# EAGLE schematic WaveFolder (EAGLE 9.6.2)
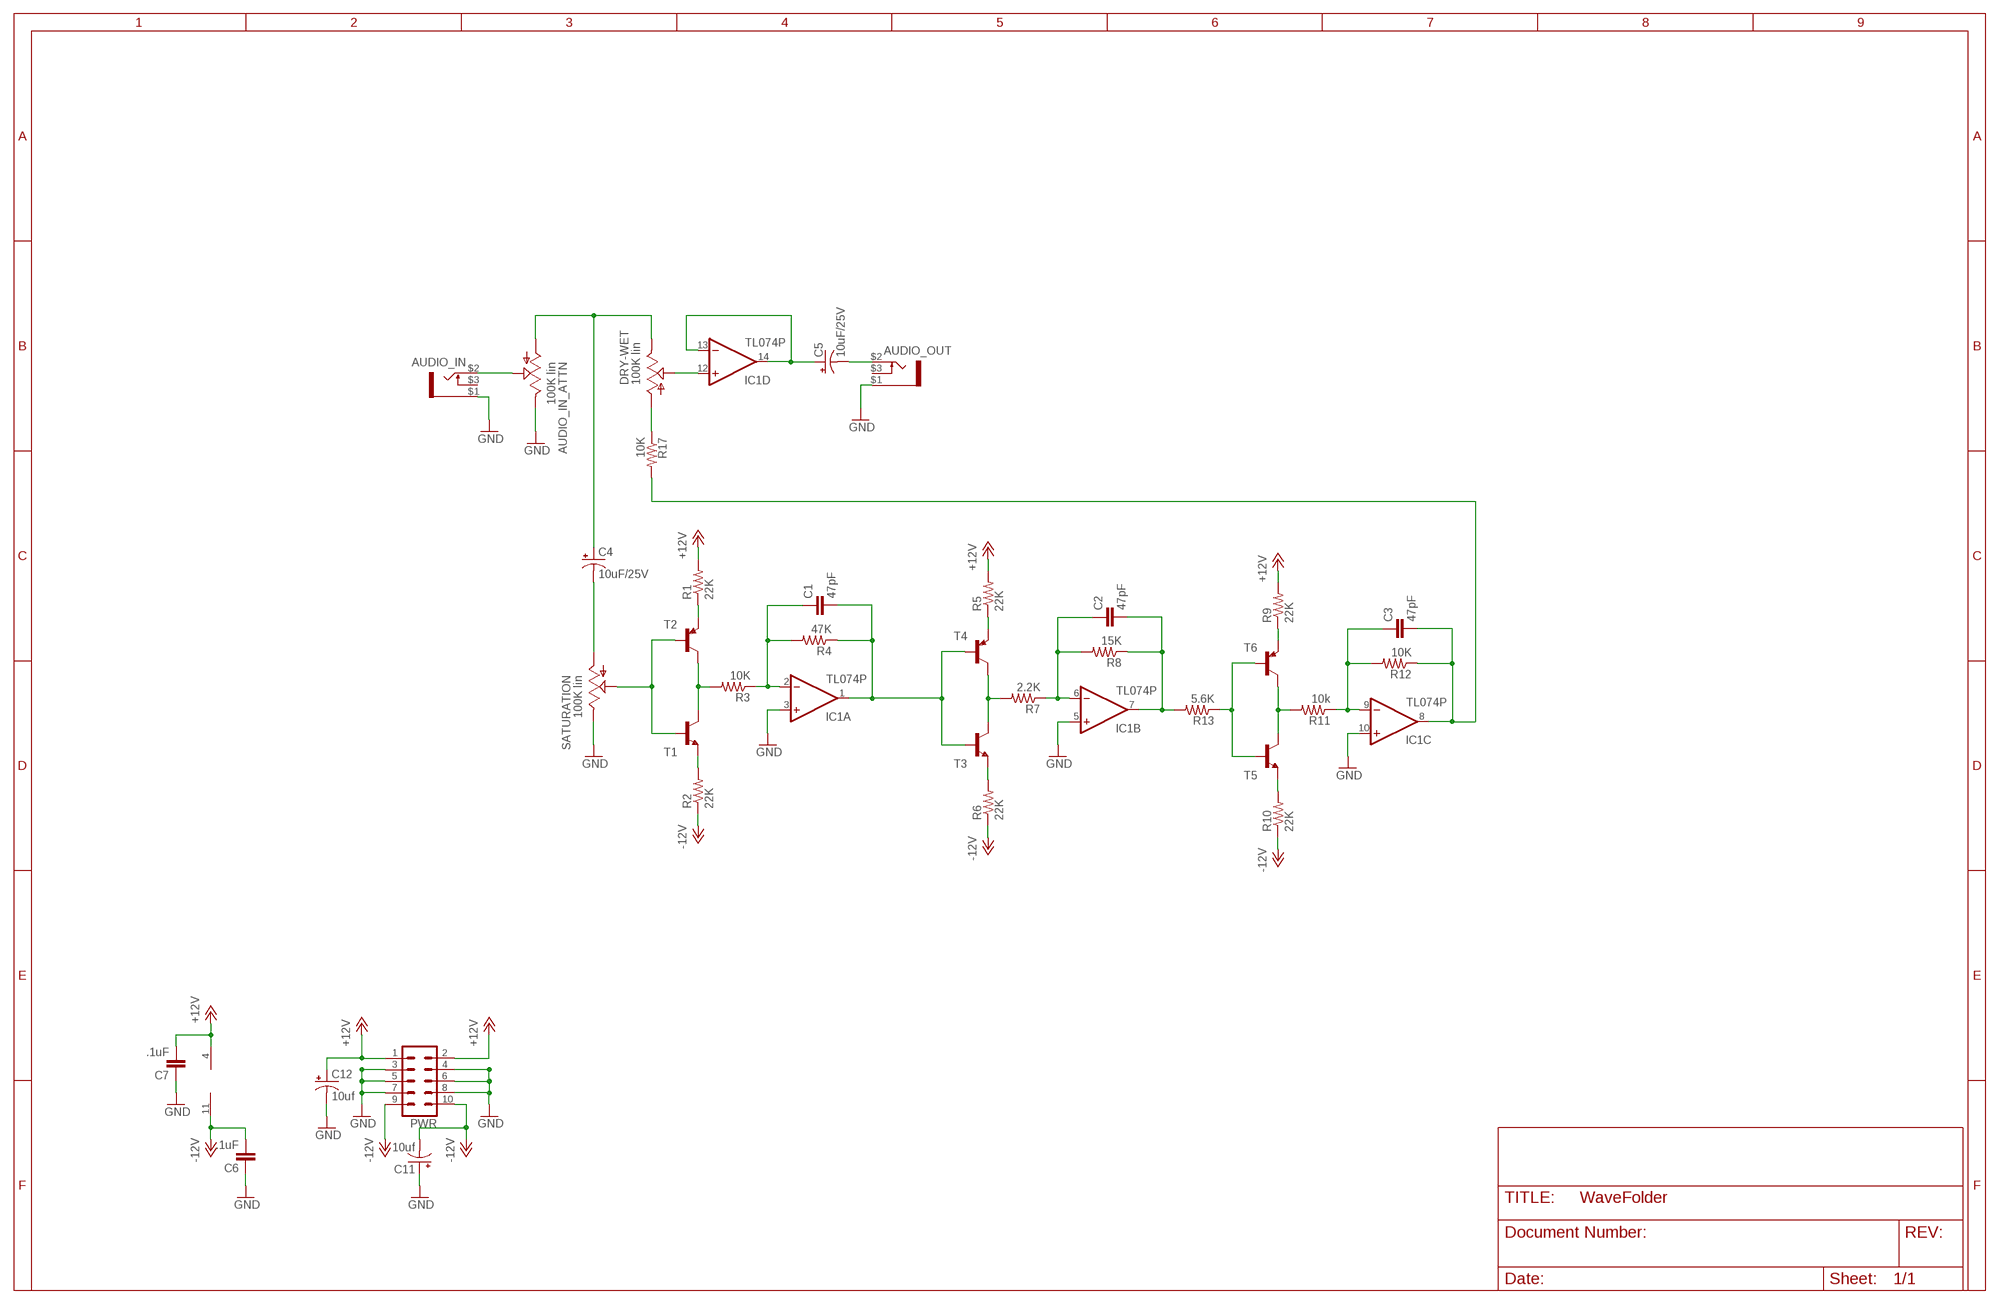
[diagram p0: schematic, sheet 1]

## Parts
AUDIO_IN  PJ-323PJ-323  [PJ-323]
AUDIO_IN_ATTN  100K lin  RIGHT-ANGLE-POTA  [EVUF]
AUDIO_OUT  PJ-323PJ-323  [PJ-323]
C1  47pF  C-EU025-024X044  [C025-024X044]
C2  47pF  C-EU025-024X044  [C025-024X044]
C3  47pF  C-EU025-024X044  [C025-024X044]
C4  10uF/25V  CPOL-USE2.5-6  [E2,5-6]
C5  10uF/25V  CPOL-USE2.5-6  [E2,5-6]
C6  .1uF  C-EU025-024X044  [C025-024X044]
C7  .1uF  C-EU025-024X044  [C025-024X044]
C11  10uf  CPOL-USE2.5-5  [E2,5-5]
C12  10uf  CPOL-USE2.5-5  [E2,5-5]
DRY-WET  100K lin  RIGHT-ANGLE-POTA  [EVUF]
IC1  TL074P  [DIL14]
PWR  ML10  [ML10]
R1  22K  R-US_0207/7  [0207/7]
R2  22K  R-US_0207/7  [0207/7]
R3  10K  R-US_0207/7  [0207/7]
R4  47K  R-US_0207/7  [0207/7]
R5  22K  R-US_0207/7  [0207/7]
R6  22K  R-US_0207/7  [0207/7]
R7  2.2K  R-US_0207/7  [0207/7]
R8  15K  R-US_0207/7  [0207/7]
R9  22K  R-US_0207/7  [0207/7]
R10  22K  R-US_0207/7  [0207/7]
R11  10k  R-US_0207/7  [0207/7]
R12  10K  R-US_0207/7  [0207/7]
R13  5.6K  R-US_0207/7  [0207/7]
R17  10K  R-US_0207/7  [0207/7]
SATURATION  100K lin  RIGHT-ANGLE-POTA  [EVUF]
T1  2N3904-NPN-TO92-EBC  [TO92-EBC]
T2  2N3906-PNP-TO92-EBC  [TO92-EBC]
T3  2N3904-NPN-TO92-EBC  [TO92-EBC]
T4  2N3906-PNP-TO92-EBC  [TO92-EBC]
T5  2N3904-NPN-TO92-EBC  [TO92-EBC]
T6  2N3906-PNP-TO92-EBC  [TO92-EBC]

## Nets
+12V: C7.2 C12.+ IC1.4(P:V+) PWR.1 PWR.2 R1.2 R5.2 R9.2
-12V: C6.2 C11.- IC1.11(P:V-) PWR.9 PWR.10 R2.1 R6.1 R10.1
GND: AUDIO_IN.$1 AUDIO_IN_ATTN.3(E) AUDIO_OUT.$1 C6.1 C7.1 C11.+ C12.- IC1.3(A:+IN) IC1.5(B:+IN) IC1.10(C:+IN) PWR.3 PWR.4 PWR.5 PWR.6 PWR.7 PWR.8 SATURATION.3(E)
N$1: R3.2 T1.C T2.C
N$2: SATURATION.2(S) T1.B T2.B
N$3: R1.1 T2.E
N$4: R2.2 T1.E
N$5: C1.1 IC1.2(A:-IN) R3.1 R4.2
N$6: C1.2 IC1.1(A:OUT) R4.1 T3.B T4.B
N$7: R7.2 T3.C T4.C
N$8: C4.- SATURATION.1(A)
N$9: R5.1 T4.E
N$10: R6.2 T3.E
N$11: C2.1 IC1.6(B:-IN) R7.1 R8.2
N$12: C2.2 IC1.7(B:OUT) R8.1 R13.2
N$13: R11.2 T5.C T6.C
N$14: R13.1 T5.B T6.B
N$15: R9.1 T6.E
N$16: R10.2 T5.E
N$17: C3.1 IC1.9(C:-IN) R11.1 R12.2
N$18: C3.2 IC1.8(C:OUT) R12.1 R17.2
N$19: AUDIO_IN.$2 AUDIO_IN_ATTN.2(S)
N$20: AUDIO_IN_ATTN.1(A) C4.+ DRY-WET.3(E)
N$21: DRY-WET.1(A) R17.1
N$22: DRY-WET.2(S) IC1.12(D:+IN)
N$23: C5.+ IC1.13(D:-IN) IC1.14(D:OUT)
N$24: AUDIO_OUT.$2 C5.-
Unconnected: AUDIO_IN.$3 AUDIO_OUT.$3

## Library data of the parts
AUDIO_IN AUDIO_OUT = gerbster:PJ-323
AUDIO_IN_ATTN DRY-WET SATURATION = gerbster:RIGHT-ANGLE-POT: 9 mm Square Rotary Potentiometers Source: Panasonic
C1-C3 C6 C7 = rcl:C-EU: CAPACITOR, European symbol; SPICEPREFIX: C
C4 C5 = rcl:CPOL-US: POLARIZED CAPACITOR, American symbol; SPICEPREFIX: C
C11 C12 = resistor:CPOL-US: POLARIZED CAPACITOR, American symbol
IC1 = linear:TL074: OP AMP
PWR = con-ml:ML10: HARTING; OC_FARNELL: unknown; OC_NEWARK: unknown
R1-R13 R17 = rcl:R-US_: RESISTOR, American symbol; SPICEPREFIX: R
T1 T3 T5 = transistor-neu-to92:*-NPN-: NPN Transistror
T2 T4 T6 = transistor-neu-to92:*-PNP-: PNP Transistror